# EAGLE design SAME70N21-CU (EAGLE 9.6.1)
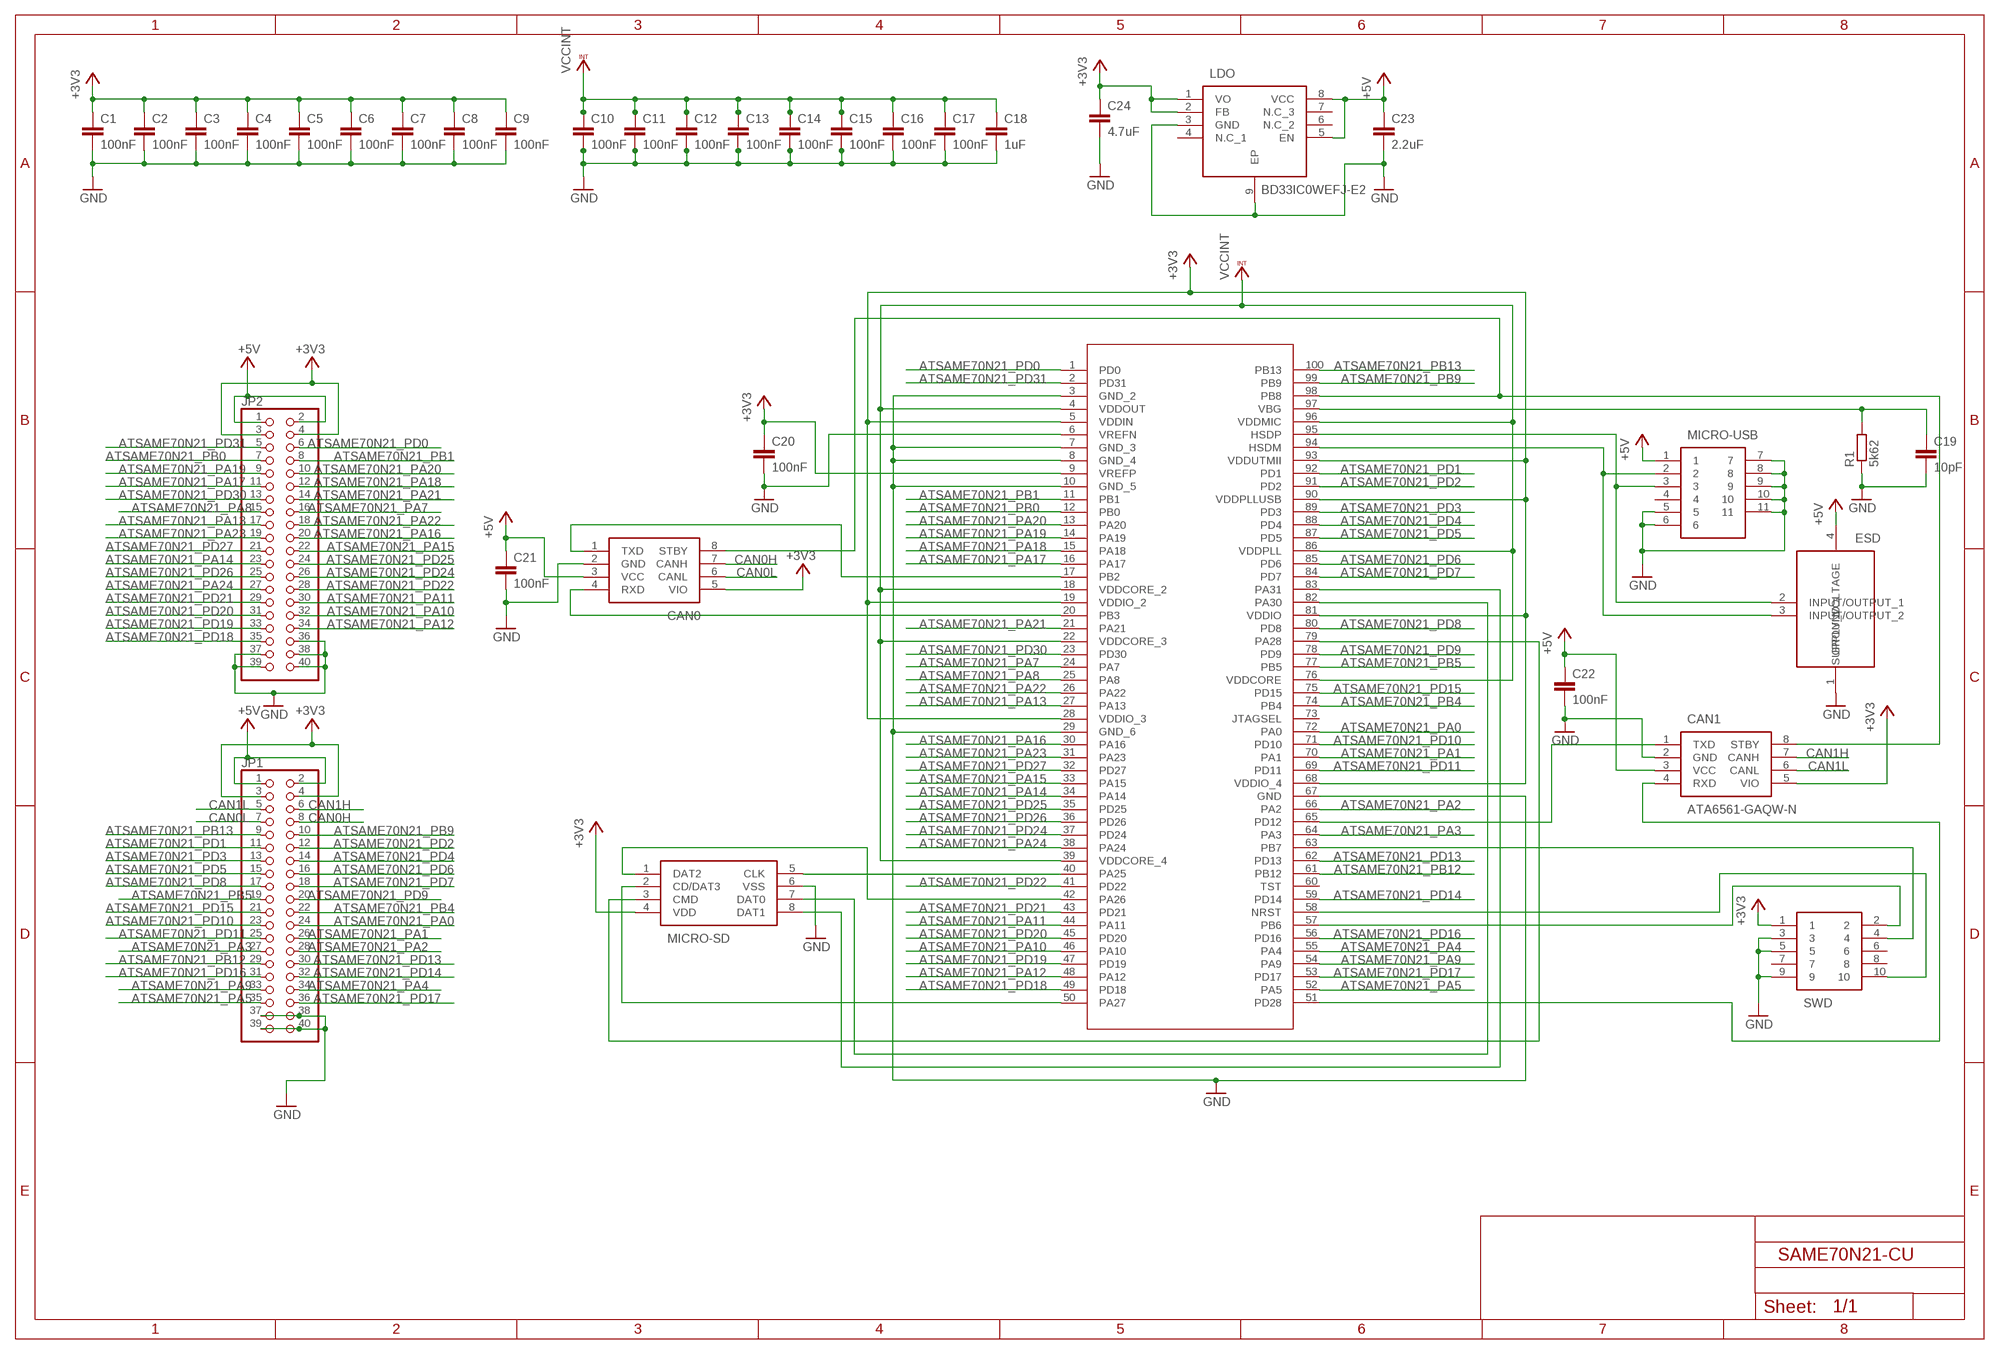
[diagram p0: schematic, sheet 1]

## Parts
C1  100nF  C-EUC1206  [C1206]
C2  100nF  C-EUC1206  [C1206]
C3  100nF  C-EUC1206  [C1206]
C4  100nF  C-EUC1206  [C1206]
C5  100nF  C-EUC1206  [C1206]
C6  100nF  C-EUC1206  [C1206]
C7  100nF  C-EUC1206  [C1206]
C8  100nF  C-EUC1206  [C1206]
C9  100nF  C-EUC1206  [C1206]
C10  100nF  C-EUC1206  [C1206]
C11  100nF  C-EUC1206  [C1206]
C12  100nF  C-EUC1206  [C1206]
C13  100nF  C-EUC1206  [C1206]
C14  100nF  C-EUC1206  [C1206]
C15  100nF  C-EUC1206  [C1206]
C16  100nF  C-EUC1206  [C1206]
C17  100nF  C-EUC1206  [C1206]
C18  1uF  C-EUC1206  [C1206]
C19  10pF  C-EUC1206  [C1206]
C20  100nF  C-EUC1206  [C1206]
C21  100nF  C-EUC1206  [C1206]
C22  100nF  C-EUC1206  [C1206]
C23  2.2uF  C-EUC1206  [C1206]
C24  4.7uF  C-EUC1206  [C1206]
CAN0  ATA6561-GAQW-N  [SOIC127P600X175-8N]
CAN1  ATA6561-GAQW-N  [SOIC127P600X175-8N]
ESD  PRTR5V0U2X,215  [PRTR5V0U2X]
JP1  PINHD-2X20  [2X20]
JP2  PINHD-2X20  [2X20]
LDO  BD33IC0WEFJ-E2  [SOIC127P600X100-9N]
MICRO-SD  104031-0811  [1040310811]
MICRO-USB  10118192-0001LF  [101181920001LF]
R1  5k62  R-EU_R1206  [R1206]
SWD  62201021121  [WURTH-1.27MM-PITCH-2WAY]
U1  ATSAME70N21A-ANTQFP100_14X14MC_MCH-M  [TQFP100_14X14MC_MCH-M]

## Nets
+3V3: C1.1 C2.1 C3.1 C4.1 C5.1 C6.1 C7.1 C8.1 C9.1 C20.1 C24.1 CAN0.5(VIO) CAN1.5(VIO) JP1.3 JP1.4 JP2.3 JP2.4 LDO.1(VO) LDO.2(FB) MICRO-SD.4(VDD) SWD.1 U1.5(VDDIN) U1.9(VREFP) U1.19(VDDIO_2) U1.28(VDDIO_3) U1.68(VDDIO_4) U1.81(VDDIO) U1.90(VDDPLLUSB) U1.93(VDDUTMII)
+5V: C21.1 C22.1 C23.1 CAN0.3(VCC) CAN1.3(VCC) ESD.4(SUPPLY_VOLTAGE) JP1.1 JP1.2 JP2.1 JP2.2 LDO.5(EN) LDO.8(VCC) MICRO-USB.1
ATSAME70N21_PA0: JP1.24 U1.72(PA0)
ATSAME70N21_PA1: JP1.26 U1.70(PA1)
ATSAME70N21_PA2: JP1.28 U1.66(PA2)
ATSAME70N21_PA3: JP1.27 U1.64(PA3)
ATSAME70N21_PA4: JP1.34 U1.55(PA4)
ATSAME70N21_PA5: JP1.35 U1.52(PA5)
ATSAME70N21_PA7: JP2.16 U1.24(PA7)
ATSAME70N21_PA8: JP2.15 U1.25(PA8)
ATSAME70N21_PA9: JP1.33 U1.54(PA9)
ATSAME70N21_PA10: JP2.32 U1.46(PA10)
ATSAME70N21_PA11: JP2.30 U1.44(PA11)
ATSAME70N21_PA12: JP2.34 U1.48(PA12)
ATSAME70N21_PA13: JP2.17 U1.27(PA13)
ATSAME70N21_PA14: JP2.23 U1.34(PA14)
ATSAME70N21_PA15: JP2.22 U1.33(PA15)
ATSAME70N21_PA16: JP2.20 U1.30(PA16)
ATSAME70N21_PA17: JP2.11 U1.16(PA17)
ATSAME70N21_PA18: JP2.12 U1.15(PA18)
ATSAME70N21_PA19: JP2.9 U1.14(PA19)
ATSAME70N21_PA20: JP2.10 U1.13(PA20)
ATSAME70N21_PA21: JP2.14 U1.21(PA21)
ATSAME70N21_PA22: JP2.18 U1.26(PA22)
ATSAME70N21_PA23: JP2.19 U1.31(PA23)
ATSAME70N21_PA24: JP2.27 U1.38(PA24)
ATSAME70N21_PB0: JP2.7 U1.12(PB0)
ATSAME70N21_PB1: JP2.8 U1.11(PB1)
ATSAME70N21_PB4: JP1.22 U1.74(PB4)
ATSAME70N21_PB5: JP1.19 U1.77(PB5)
ATSAME70N21_PB9: JP1.10 U1.99(PB9)
ATSAME70N21_PB12: JP1.29 U1.61(PB12)
ATSAME70N21_PB13: JP1.9 U1.100(PB13)
ATSAME70N21_PD0: JP2.6 U1.1(PD0)
ATSAME70N21_PD1: JP1.11 U1.92(PD1)
ATSAME70N21_PD2: JP1.12 U1.91(PD2)
ATSAME70N21_PD3: JP1.13 U1.89(PD3)
ATSAME70N21_PD4: JP1.14 U1.88(PD4)
ATSAME70N21_PD5: JP1.15 U1.87(PD5)
ATSAME70N21_PD6: JP1.16 U1.85(PD6)
ATSAME70N21_PD7: JP1.18 U1.84(PD7)
ATSAME70N21_PD8: JP1.17 U1.80(PD8)
ATSAME70N21_PD9: JP1.20 U1.78(PD9)
ATSAME70N21_PD10: JP1.23 U1.71(PD10)
ATSAME70N21_PD11: JP1.25 U1.69(PD11)
ATSAME70N21_PD13: JP1.30 U1.62(PD13)
ATSAME70N21_PD14: JP1.32 U1.59(PD14)
ATSAME70N21_PD15: JP1.21 U1.75(PD15)
ATSAME70N21_PD16: JP1.31 U1.56(PD16)
ATSAME70N21_PD17: JP1.36 U1.53(PD17)
ATSAME70N21_PD18: JP2.35 U1.49(PD18)
ATSAME70N21_PD19: JP2.33 U1.47(PD19)
ATSAME70N21_PD20: JP2.31 U1.45(PD20)
ATSAME70N21_PD21: JP2.29 U1.43(PD21)
ATSAME70N21_PD22: JP2.28 U1.41(PD22)
ATSAME70N21_PD24: JP2.26 U1.37(PD24)
ATSAME70N21_PD25: JP2.24 U1.35(PD25)
ATSAME70N21_PD26: JP2.25 U1.36(PD26)
ATSAME70N21_PD27: JP2.21 U1.32(PD27)
ATSAME70N21_PD30: JP2.13 U1.23(PD30)
ATSAME70N21_PD31: JP2.5 U1.2(PD31)
CAN0H: CAN0.7(CANH) JP1.8
CAN0L: CAN0.6(CANL) JP1.7
CAN0RX: CAN0.4(RXD) U1.20(PB3)
CAN0TX: CAN0.1(TXD) U1.17(PB2)
CAN1H: CAN1.7(CANH) JP1.6
CAN1L: CAN1.6(CANL) JP1.5
CAN1RX: CAN1.4(RXD) U1.51(PD28)
CAN1TX: CAN1.1(TXD) U1.65(PD12)
CAN-STBY: CAN0.8(STBY) CAN1.8(STBY) U1.98(PB8)
GND: C1.2 C2.2 C3.2 C4.2 C5.2 C6.2 C7.2 C8.2 C9.2 C10.2 C11.2 C12.2 C13.2 C14.2 C15.2 C16.2 C17.2 C18.2 C19.2 C20.2 C21.2 C22.2 C23.2 C24.2 CAN0.2(GND) CAN1.2(GND) ESD.1(GROUND) JP1.37 JP1.38 JP1.39 JP1.40 JP2.36 JP2.37 JP2.38 JP2.39 JP2.40 LDO.3(GND) LDO.9(EP) MICRO-SD.6(VSS) MICRO-USB.5 MICRO-USB.6 MICRO-USB.7 MICRO-USB.8 MICRO-USB.9 MICRO-USB.10 MICRO-USB.11 R1.1 SWD.3 SWD.5 SWD.9 U1.3(GND_2) U1.6(VREFN) U1.7(GND_3) U1.8(GND_4) U1.10(GND_5) U1.29(GND_6) U1.67(GND)
HSDM: ESD.3(INPUT/OUTPUT_2) MICRO-USB.2 U1.94(HSDM)
HSDP: ESD.2(INPUT/OUTPUT_1) MICRO-USB.3 U1.95(HSDP)
MSD-CLK: MICRO-SD.5(CLK) U1.40(PA25)
MSD-CMD: MICRO-SD.3(CMD) U1.79(PA28)
MSD-DAT0: MICRO-SD.7(DAT0) U1.82(PA30)
MSD-DAT1: MICRO-SD.8(DAT1) U1.83(PA31)
MSD-DAT2: MICRO-SD.1(DAT2) U1.42(PA26)
MSD-DAT3: MICRO-SD.2(CD/DAT3) U1.50(PA27)
NRST: SWD.10 U1.58(NRST)
SWCLK: SWD.4 U1.63(PB7)
SWDIO: SWD.2 U1.57(PB6)
VBG: C19.1 R1.2 U1.97(VBG)
VCCINT: C10.1 C11.1 C12.1 C13.1 C14.1 C15.1 C16.1 C17.1 C18.1 U1.4(VDDOUT) U1.18(VDDCORE_2) U1.22(VDDCORE_3) U1.39(VDDCORE_4) U1.76(VDDCORE) U1.86(VDDPLL) U1.96(VDDMIC)
Unconnected: LDO.4(N.C_1) LDO.6(N.C_2) LDO.7(N.C_3) MICRO-USB.4 SWD.6 SWD.7 SWD.8 U1.60(TST) U1.73(JTAGSEL)

## Library data of the parts
C1-C24 = rcl:C-EU: CAPACITOR, European symbol; SPICEPREFIX: C
CAN0 CAN1 = SamacSys_Parts:ATA6561-GAQW-N: MICROCHIP - ATA6561-GAQW-N - CAN TRANSCEIVER, 5MBPS, -40 TO 150DEG C Source: Datasheet <http://ww1.microchip.com/downloads/en/DeviceDoc/ATA6560-ATA6561-High-Speed-CAN-Transceiver-DS20005991A.pdf>; DESCRIPTION: MICROCHIP - ATA6561-GAQW-N - CAN TRANSCEIVER, 5MBPS, -40 TO 150DEG C; HEIGHT: 1.75mm; MANUFACTURER_NAME: Microchip; MANUFACTURER_PART_NUMBER: ATA6561-GAQW-N; MOUSER_PART_NUMBER: 579-ATA6561-GAQW-N; MOUSER_PRICE-STOCK: https://www.mouser.co.uk/ProductDetail/Microchip-Technology-Atmel/ATA6561-GAQW-N?qs=y6ZabgHbY%252BwGbm2JCZMHKQ%3D%3D
ESD = SamacSys_Parts:PRTR5V0U2X,215: ESD Protection Diodes 5.5V Dual SOT143B NXP PRTR5V0U2X,215 Dual Uni-Directional TVS Diode, 4-Pin SOT-143B Source: Datasheet <https://assets.nexperia.com/documents/data-sheet/PRTR5V0U2X.pdf>; DESCRIPTION: ESD Protection Diodes 5.5V Dual SOT143B NXP PRTR5V0U2X,215 Dual Uni-Directional TVS Diode, 4-Pin SOT-143B; HEIGHT: 1.1mm; MANUFACTURER_NAME: Nexperia; MANUFACTURER_PART_NUMBER: PRTR5V0U2X,215; MOUSER_PART_NUMBER: 771-PRTR5V0U2X-T/R; MOUSER_PRICE-STOCK: https://www.mouser.co.uk/ProductDetail/Nexperia/PRTR5V0U2X215?qs=LOCUfHb8d9sDkgY4cRj8Lw%3D%3D
JP1 JP2 = pinhead:PINHD-2X20: PIN HEADER
LDO = SamacSys_Parts:BD33IC0WEFJ-E2: LDO regulator,3.3V,1A,shutdown,HTSOP-J8 ROHM BD33IC0WEFJ-E2, LDO Voltage Regulator, 1A, 3.3 V +/-1%, 2.4 5.5 Vin, 8-Pin HTSOP-J8 Source: Datasheet <http://rohmfs.rohm.com/en/products/databook/datasheet/ic/power/linear_regulator/bdxxic0w-e.pdf>; DESCRIPTION: LDO regulator,3.3V,1A,shutdown,HTSOP-J8 ROHM BD33IC0WEFJ-E2, LDO Voltage Regulator, 1A, 3.3 V +/-1%, 2.4 5.5 Vin, 8-Pin HTSOP-J8; HEIGHT: 1mm; MANUFACTURER_NAME: ROHM Semiconductor; MANUFACTURER_PART_NUMBER: BD33IC0WEFJ-E2; MOUSER_PART_NUMBER: 755-BD33IC0WEFJ-E2; MOUSER_PRICE-STOCK: https://www.mouser.co.uk/ProductDetail/ROHM-Semiconductor/BD33IC0WEFJ-E2?qs=QbAZ1slfEbT8jlYSJB9fUg%3D%3D
MICRO-SD = SamacSys_Parts:104031-0811: microSD 1.10mm SMT push-pull memory card microSD 1.10mm SMT push-pull memory card Source: Datasheet <http://www.molex.com/webdocs/datasheets/pdf/en-us/1040310811_MEMORY_CARD_SOCKET.pdf>; DESCRIPTION: microSD 1.10mm SMT push-pull memory card microSD 1.10mm SMT push-pull memory card; HEIGHT: mm; MANUFACTURER_NAME: Molex; MANUFACTURER_PART_NUMBER: 104031-0811; MOUSER_PART_NUMBER: 538-104031-0811; MOUSER_PRICE-STOCK: https://www.mouser.co.uk/ProductDetail/Molex/104031-0811?qs=udsGRKD4nA3Tvy7wqky%252BuA%3D%3D
MICRO-USB = SamacSys_Parts:10118192-0001LF: USB Connectors 5P MICRO USB TYPE B RECEPTACLE Source: Datasheet <https://www.mouser.tw/datasheet/2/18/10118192-1361887.pdf>; ARROW_PART_NUMBER: 10118192-0001LF; ARROW_PRICE-STOCK: https://www.arrow.com/en/products/10118192-0001lf/amphenol-fci?region=nac; DESCRIPTION: USB Connectors 5P MICRO USB TYPE B RECEPTACLE; HEIGHT: 2.8mm; MANUFACTURER_NAME: Amphenol; MANUFACTURER_PART_NUMBER: 10118192-0001LF; MOUSER_PART_NUMBER: 649-10118192-0001LF; MOUSER_PRICE-STOCK: https://www.mouser.co.uk/ProductDetail/Amphenol-FCI/10118192-0001LF?qs=Ywefl8B65e5bHFoQtIudZg%3D%3D
R1 = rcl:R-EU_: RESISTOR, European symbol; SPICEPREFIX: R
SWD = SamacSys_Parts:62201021121: Wurth Elektronik WR-PHD Series, Series Number 6220, 1.27mm Pitch 10 Way 2 Row Straight PCB Header, Solder Termination Source: Datasheet <http://katalog.we-online.de/em/datasheet/6220xx21121.pdf>; DESCRIPTION: Wurth Elektronik WR-PHD Series, Series Number 6220, 1.27mm Pitch 10 Way 2 Row Straight PCB Header, Solder Termination; HEIGHT: mm; MANUFACTURER_NAME: Wurth Elektronik; MANUFACTURER_PART_NUMBER: 62201021121; MOUSER_PART_NUMBER: 710-62201021121; MOUSER_PRICE-STOCK: https://www.mouser.co.uk/ProductDetail/Wurth-Elektronik/62201021121?qs=PhR8RmCirEZWrjKrFMt0Bg%3D%3D
U1 = u_mcu_atmel_atsame70n21_lqfp100:ATSAME70N21A-AN; COPYRIGHT: Copyright (C) 2022 Ultra Librarian. All rights reserved.; MANUFACTURER_PART_NUMBER: ATSAME70N21A-AN; MFR_NAME: Microchip

## Board
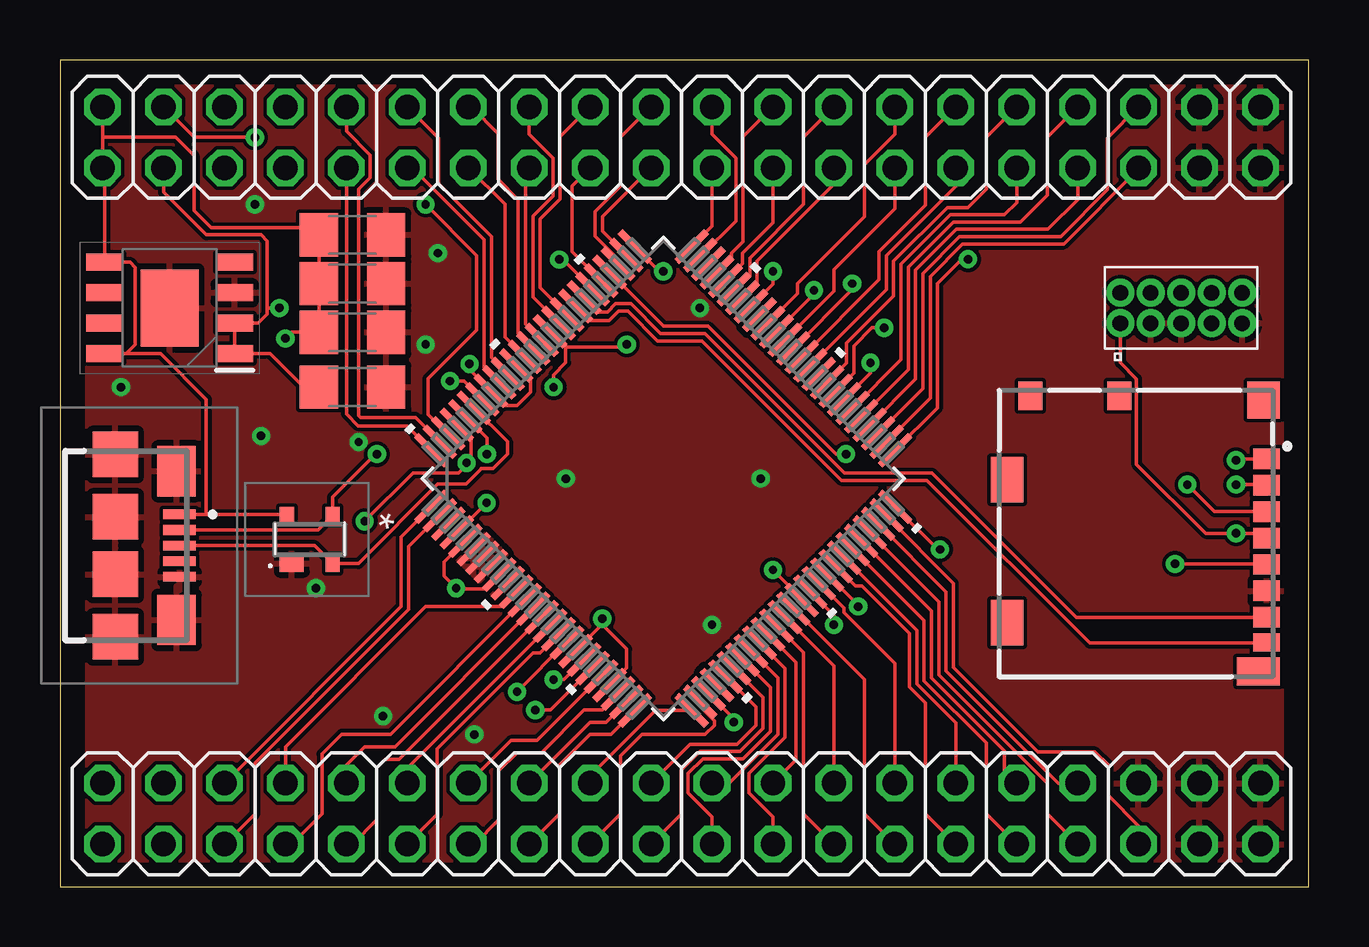
[diagram p1: board, top side]
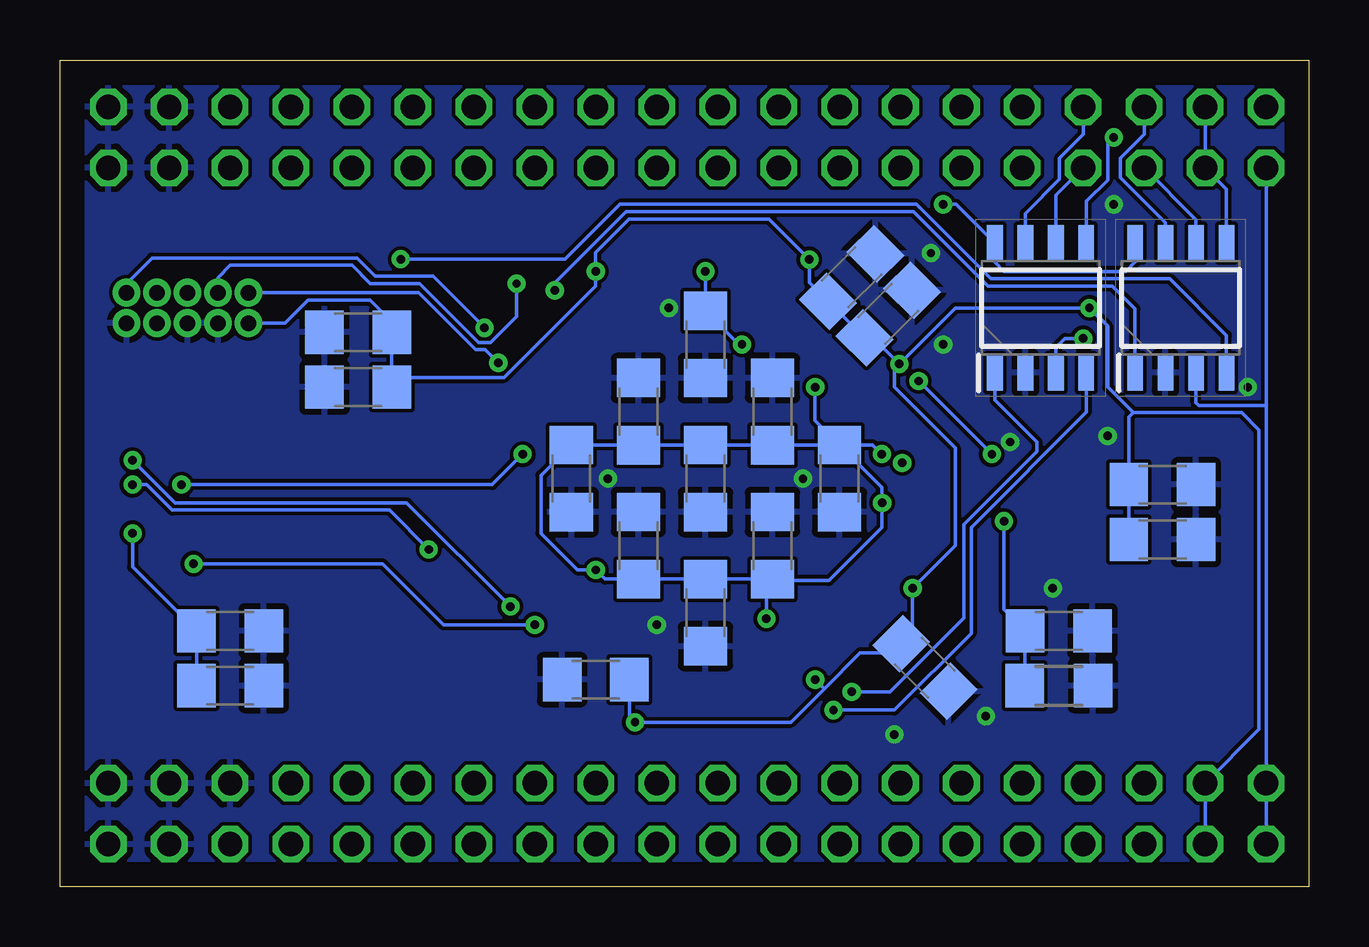
[diagram p2: board, bottom side, seen from below]

Size 52.05 x 34.47 mm. Coordinates in mm from the lower left corner, seen from the top.
Outline: 0,0 52.05,0 52.05,34.47 0,34.47 0,0
Copper layers (1*16): Top 0.035mm / dielectric 1.5mm / Bottom 0.035mm
Design rules "default": minimum track width 6mil, minimum drill 0.35mm, track to track 6mil, track to pad 6mil, pad to pad 6mil, via to via 6mil, smd to smd 6mil, copper to edge 40mil, drill to drill 6mil, minimum pad ring 10mil, minimum via ring 8mil, stop-mask expansion 4mil, vias tented up to drill 0mil, thermal gap 10mil

### Footprints (pad centres in the part's own frame; a part is rotated, then mirrored left to right if it is on the bottom)
C1206 = smd 1.6 x 1.8: 1 -1.4,0; 2 1.4,0
SOIC127P600X175-8N = smd 1.5 x 0.65: 1 -2.7,1.905; 2 -2.7,0.635; 3 -2.7,-0.635; 4 -2.7,-1.905; 5 2.7,-1.905; 6 2.7,-0.635; 7 2.7,0.635; 8 2.7,1.905
PRTR5V0U2X = smd 1 x 0.7: 1 -0.75,-1 | smd 0.6 x 0.7: 2 0.95,-1; 3 0.95,1; 4 -0.95,1
2X20 = drill 1.016 octagon: 1 -24.13,-1.27; 2 -24.13,1.27; 3 -21.59,-1.27; 4 -21.59,1.27; 5 -19.05,-1.27; 6 -19.05,1.27; 7 -16.51,-1.27; 8 -16.51,1.27; 9 -13.97,-1.27; 10 -13.97,1.27; 11 -11.43,-1.27; 12 -11.43,1.27; 13 -8.89,-1.27; 14 -8.89,1.27; 15 -6.35,-1.27; 16 -6.35,1.27; 17 -3.81,-1.27; 18 -3.81,1.27; 19 -1.27,-1.27; 20 -1.27,1.27; 21 1.27,-1.27; 22 1.27,1.27; 23 3.81,-1.27; 24 3.81,1.27; 25 6.35,-1.27; 26 6.35,1.27; 27 8.89,-1.27; 28 8.89,1.27; 29 11.43,-1.27; 30 11.43,1.27; 31 13.97,-1.27; 32 13.97,1.27; 33 16.51,-1.27; 34 16.51,1.27; 35 19.05,-1.27; 36 19.05,1.27; 37 21.59,-1.27; 38 21.59,1.27; 39 24.13,-1.27; 40 24.13,1.27
SOIC127P600X100-9N = smd 1.525 x 0.7: 1 -2.712,1.905; 2 -2.712,0.635; 3 -2.712,-0.635; 4 -2.712,-1.905; 5 2.712,-1.905; 6 2.712,-0.635; 7 2.712,0.635; 8 2.712,1.905 | smd 2.4 x 3.2: 9 0,0
1040310811 = smd 0.85 x 1.1: 1 3.105,0.25; 2 2.005,0.25; 3 0.905,0.25; 4 -0.195,0.25; 5 -1.295,0.25; 6 -2.395,0.25; 7 -3.495,0.25 | smd 0.75 x 1.1: 8 -4.545,0.25 | smd 1.17 x 1.8: 9 -5.755,0.6 | smd 1.9 x 1.35: 10 -3.73,11.075; 11 2.24,11.075 | smd 1.2 x 1: 12 5.74,10.1; 13 5.74,6.4 | smd 1.55 x 1.35: 14 5.565,0.375
101181920001LF = smd 0.4 x 1.35: 1 -1.3,1.682; 2 -0.65,1.682; 3 0,1.682; 4 0.65,1.682; 5 1.3,1.682 | smd 2.1 x 1.6: 6 -3.1,1.557; 7 3.1,1.557 | smd 1.9 x 1.9: 8 -1.2,-0.993; 9 1.2,-0.993; 10 -3.8,-0.993; 11 3.8,-0.993
R1206 = smd 1.6 x 1.803: 1 -1.422,0; 2 1.422,0
WURTH-1.27MM-PITCH-2WAY = drill 0.65 pad 1.05: 1 -2.54,-0.635; 2 -2.54,0.635; 3 -1.27,-0.635; 4 -1.27,0.635; 5 0,-0.635; 6 0,0.635; 7 1.27,-0.635; 8 1.27,0.635; 9 2.54,-0.635; 10 2.54,0.635
TQFP100_14X14MC_MCH-M = smd 1.762 x 0.279: 1 -7.67,6; 2 -7.67,5.5; 3 -7.67,5; 4 -7.67,4.5; 5 -7.67,4; 6 -7.67,3.5; 7 -7.67,3; 8 -7.67,2.5; 9 -7.67,2; 10 -7.67,1.5; 11 -7.67,1; 12 -7.67,0.5; 13 -7.67,0; 14 -7.67,-0.5; 15 -7.67,-1; 16 -7.67,-1.5; 17 -7.67,-2; 18 -7.67,-2.5; 19 -7.67,-3; 20 -7.67,-3.5; 21 -7.67,-4; 22 -7.67,-4.5; 23 -7.67,-5; 24 -7.67,-5.5; 25 -7.67,-6; 51 7.67,-6; 52 7.67,-5.5; 53 7.67,-5; 54 7.67,-4.5; 55 7.67,-4; 56 7.67,-3.5; 57 7.67,-3; 58 7.67,-2.5; 59 7.67,-2; 60 7.67,-1.5; 61 7.67,-1; 62 7.67,-0.5; 63 7.67,0; 64 7.67,0.5; 65 7.67,1; 66 7.67,1.5; 67 7.67,2; 68 7.67,2.5; 69 7.67,3; 70 7.67,3.5; 71 7.67,4; 72 7.67,4.5; 73 7.67,5; 74 7.67,5.5; 75 7.67,6 | smd 0.279 x 1.762: 26 -6,-7.67; 27 -5.5,-7.67; 28 -5,-7.67; 29 -4.5,-7.67; 30 -4,-7.67; 31 -3.5,-7.67; 32 -3,-7.67; 33 -2.5,-7.67; 34 -2,-7.67; 35 -1.5,-7.67; 36 -1,-7.67; 37 -0.5,-7.67; 38 0,-7.67; 39 0.5,-7.67; 40 1,-7.67; 41 1.5,-7.67; 42 2,-7.67; 43 2.5,-7.67; 44 3,-7.67; 45 3.5,-7.67; 46 4,-7.67; 47 4.5,-7.67; 48 5,-7.67; 49 5.5,-7.67; 50 6,-7.67; 76 6,7.67; 77 5.5,7.67; 78 5,7.67; 79 4.5,7.67; 80 4,7.67; 81 3.5,7.67; 82 3,7.67; 83 2.5,7.67; 84 2,7.67; 85 1.5,7.67; 86 1,7.67; 87 0.5,7.67; 88 0,7.67; 89 -0.5,7.67; 90 -1,7.67; 91 -1.5,7.67; 92 -2,7.67; 93 -2.5,7.67; 94 -3,7.67; 95 -3.5,7.67; 96 -4,7.67; 97 -4.5,7.67; 98 -5,7.67; 99 -5.5,7.67; 100 -6,7.67

### Placement (x,y rotation side)
C1  6.1,14.48 0 bottom
C2  16,9.14 315 bottom
C3  29.72,8.64 180 bottom
C4  39.62,23.11 180 bottom
C5  39.62,20.83 180 bottom
C6  19.05,25.4 45 bottom
C7  44.96,10.67 0 bottom
C8  17.53,23.88 45 bottom
C9  44.96,8.38 0 bottom
C10  25.15,22.61 270 bottom
C11  27.94,19.81 90 bottom
C12  22.35,19.81 90 bottom
C13  27.94,14.22 90 bottom
C14  19.56,17.02 270 bottom
C15  25.15,11.43 270 bottom
C16  22.35,14.22 90 bottom
C17  30.73,17.02 270 bottom
C18  25.15,17.02 270 bottom
C19  10.41,10.67 0 bottom
C20  6.1,16.76 0 bottom
C21  12.19,25.15 0 top
C22  12.19,23.11 0 top
C23  12.19,27.18 0 top
C24  12.19,20.83 0 top
CAN0  11.18,24.13 90 bottom
CAN1  5.33,24.13 90 bottom
ESD  10.41,14.48 0 top
JP1  25.91,31.24 0 top
JP2  25.91,3.05 0 top
LDO  4.57,24.13 180 top
MICRO-SD  50.55,14.73 90 top
MICRO-USB  3.3,14.22 270 top
R1  10.41,8.38 180 bottom
SWD  46.74,24.13 0 top
U1  25.15,17.02 45 top

### Tracks (layer width: path | path; a pad name or v marks a point on that pad's centre or on a via)
+3V3  (via drill 0.35)
  Top 0.152: 8.64,24.13 8.64,23.88 8.26,23.5 LDO.2 LDO.1 8.76,22.23 10.16,20.83 C24.1 | 8.64,24.13 8.64,26.92 8.38,27.18 6.1,27.18 4.32,28.96 JP1.3 | v8.13,31.24 5.59,31.24 JP1.4 | 8.64,24.13 v9.14,24.13 | v17.07,21.8 17.07,21.56 U1.93 18.56,20.07 19.05,20.07 19.61,20.63 19.61,21.14 U1.90 | v20.81,26.15 20.96,26.15 U1.81 | v29.72,25.65 29.72,25.13 U1.68 | U1.28 28.08,7.01 v28.08,6.86 | U1.5 16,13.53 16,12.95 v16.51,12.45 16.54,12.41 17.71,12.41 U1.9 | U1.19 21.01,8.64 v20.57,8.64 | SWD.1 44.2,21.84 44.88,21.17 44.88,17.61 47.75,14.73 v49.02,14.73 50.1,14.73 MICRO-SD.4
  Bottom 0.152: JP1.4 JP1.3 3.43,29.08 CAN1.5 | CAN0.5 9.27,28.57 8.38,29.46 8.38,30.99 v8.13,31.24 | v17.07,21.8 14.73,24.13 v9.14,24.13 8.38,23.37 8.38,20.83 7.32,19.76 | v17.07,21.8 18.16,22.89 C8.1 C6.1 20.81,25.18 v20.81,26.15 22.5,27.84 28.32,27.84 29.72,26.44 v29.72,25.65 29.72,25.05 33.53,21.24 37.81,21.24 C5.1 C4.1 38.22,23.57 39.12,24.46 41.7,24.46 42.67,23.5 SWD.1 | 7.32,19.76 2.79,19.76 2.08,19.05 2.08,6.55 JP2.4 JP2.3 | 20.19,8.26 18.7,9.75 17.38,9.75 C2.1 16.51,10.62 v16.51,12.45 14.73,14.22 14.73,18.29 17.27,20.83 17.27,21.59 v17.07,21.8 | 20.19,8.26 21.59,6.86 v28.08,6.86 28.32,7.09 C3.1 | C1.1 C20.1 7.5,19.58 7.32,19.76 | v20.57,8.64 20.19,8.26 | v49.02,14.73 49.02,13.33 C7.1 C9.1
+5V  (via drill 0.35)
  Top 0.152: MICRO-USB.1 6.1,15.52 | 6.1,15.52 9.42,15.52 ESD.4 | 6.1,15.52 6.1,20.32 4.19,22.23 LDO.8 2.76,22.23 3.14,22.61 3.14,25.81 2.92,26.04 LDO.5 1.86,29.89 JP1.1 1.78,31.24 | 1.78,31.24 JP1.2 | 1.78,31.24 4.83,31.24 5.59,30.48 5.59,28.19 6.3,27.48 10.49,27.48 C23.1 C21.1 10.79,23.24 10.67,23.11 | v9.4,22.86 9.65,23.11 10.67,23.11 | 10.67,23.11 C22.1
  Bottom 0.152: CAN0.3 10.54,22.48 10.16,22.86 v9.4,22.86 | JP1.1 1.78,20.07 | 1.78,20.07 JP2.2 JP2.1 | 1.78,20.07 4.57,20.07 4.7,20.19 CAN1.3
ATSAME70N21_PA0
  Top 0.152: U1.72 27.45,25.62 27.98,26.15 27.98,26.41 28.47,26.89 28.47,31.27 JP1.24
ATSAME70N21_PA1
  Top 0.152: U1.70 28.16,24.92 28.75,25.51 28.75,26.21 30.99,28.45 30.99,31.24 JP1.26
ATSAME70N21_PA2
  Top 0.152: JP1.28 34.8,31.37 33.53,30.1 33.53,27.94 30.73,25.15 30.73,24.73 U1.66
ATSAME70N21_PA3
  Top 0.152: JP1.27 34.8,28.27 32.26,25.73 32.26,24.84 U1.64
ATSAME70N21_PA4
  Top 0.152: U1.55 35.36,21.57 35.36,25.82 37.24,27.71 40.03,27.71 41.15,28.82 41.15,31.24 JP1.34
ATSAME70N21_PA5
  Top 0.152: JP1.35 44.96,29.92 41.84,26.8 37.62,26.8 36.27,25.45 36.27,20.36 U1.52
ATSAME70N21_PA7
  Top 0.152: U1.24 22.76,6.86 22.1,6.86 JP2.16
ATSAME70N21_PA8
  Top 0.152: JP2.15 20.83,3.05 20.83,5.08 22.1,6.35 22.96,6.35 U1.25
ATSAME70N21_PA9
  Top 0.152: JP1.33 42.42,28.65 41.18,27.41 37.37,27.41 35.66,25.7 35.66,21.17 U1.54
ATSAME70N21_PA10
  Top 0.152: U1.46 36.32,11.5 36.32,8.71 39.37,5.67 39.37,4.83 JP2.32
ATSAME70N21_PA11
  Top 0.152: U1.44 35.71,10.69 35.71,8.46 37.34,6.83 JP2.30
ATSAME70N21_PA12
  Top 0.152: U1.48 36.93,12.3 36.93,8.99 41.61,4.32 JP2.34
ATSAME70N21_PA13
  Top 0.152: JP2.17 23.37,3.05 23.37,5.46 24.26,6.35 26.89,6.35 27.28,6.73 27.28,6.92 26.68,7.52 U1.27
ATSAME70N21_PA14
  Top 0.152: U1.34 30.23,9.11 30.23,6.23 28.73,4.73 28.73,3.91 29.72,2.92 JP2.23
ATSAME70N21_PA15
  Top 0.152: U1.33 29.92,8.71 29.92,6.35 27.89,4.32 JP2.22
ATSAME70N21_PA16
  Top 0.152: U1.30 29.01,7.5 29.01,6.73 28.22,5.94 26.26,5.94 JP2.20
ATSAME70N21_PA17
  Top 0.152: U1.16 20,9.75 19.72,9.75 15.72,5.75 15.72,3.02 JP2.11
ATSAME70N21_PA18
  Top 0.152: U1.15 14.48,4.94 JP2.12
ATSAME70N21_PA19
  Top 0.152: JP2.9 12.19,1.78 13.21,2.79 13.21,4.96 13.56,5.31 14.14,5.31 U1.14
ATSAME70N21_PA20
  Top 0.152: JP2.10 11.94,5.08 12.7,5.84 13.97,5.84 U1.13
ATSAME70N21_PA21
  Top 0.152: U1.21 19.88,6.1 18.8,6.1 JP2.14
ATSAME70N21_PA22
  Top 0.152: JP2.18 22.1,4.62 24.83,7.35 U1.26
ATSAME70N21_PA23
  Top 0.152: JP2.19 25.88,3.02 25.88,4.86 26.67,5.64 28.34,5.64 29.31,6.61 29.31,7.9 U1.31
ATSAME70N21_PA24
  Top 0.152: U1.38 33.53,8.64 33.53,3.05 JP2.27
ATSAME70N21_PB0
  Top 0.152: U1.12 13.78,6.36 11.75,6.36 10.92,5.53 10.92,3.05 9.65,1.78 JP2.7
ATSAME70N21_PB1
  Top 0.152: U1.11 18.4,11.68 15.24,11.68 9.4,5.84 JP2.8
ATSAME70N21_PB4
  Top 0.152: U1.74 26.75,26.33 28.17,27.75 28.17,30.38 27.18,31.37 JP1.22
ATSAME70N21_PB5
  Top 0.152: U1.77 22.61,27.34 22.61,27.94 JP1.19
ATSAME70N21_PB9
  Top 0.152: U1.99 14.82,19.57 12.53,19.57 12.45,19.65 12.45,29.08 12.93,29.56 12.93,30.5 11.94,31.5 JP1.10
ATSAME70N21_PB12
  Top 0.152: U1.61 34.44,24.9 34.44,26.31 37.34,29.21 JP1.29
ATSAME70N21_PB13
  Top 0.152: U1.100 14.46,19.21 12.43,19.21 11.94,19.71 JP1.9
ATSAME70N21_PD0
  Top 0.152: U1.1 14.22,14.58 14.22,11.68 JP2.6
ATSAME70N21_PD1
  Top 0.152: JP1.11 14.68,29.97 17.68,26.97 17.68,21.66 U1.92
ATSAME70N21_PD2
  Top 0.152: JP1.12 15.77,31.22 15.77,29.31 17.98,27.1 17.98,22.06 U1.91
ATSAME70N21_PD3
  Top 0.152: U1.89 18.54,22.91 18.54,28.45 JP1.13
ATSAME70N21_PD4
  Top 0.152: U1.88 19.1,23.06 19.1,28.65 18.26,29.49 18.26,31.4 17.15,32.51 JP1.14
ATSAME70N21_PD5
  Top 0.152: U1.87 19.41,23.47 19.41,29.82 JP1.15
ATSAME70N21_PD6
  Top 0.152: U1.85 19.71,24.57 19.71,27.96 20.55,28.8 20.55,30.38 19.56,31.37 JP1.16
ATSAME70N21_PD7
  Top 0.152: U1.84 20.02,24.98 20.02,27.84 20.85,28.67 20.85,31.27 JP1.18
ATSAME70N21_PD8
  Top 0.152: U1.80 21.34,26.48 21.34,29.21 JP1.17
ATSAME70N21_PD9
  Top 0.152: U1.78 23.26,26.16 22.3,27.12 22.3,28.14 23.37,29.21 23.37,31.24 JP1.20
ATSAME70N21_PD10
  Top 0.152: U1.71 28.45,25.98 28.45,26.42 29.72,27.69 JP1.23
ATSAME70N21_PD11
  Top 0.152: U1.69 28.52,24.56 29.06,25.1 29.06,26.09 32.26,29.29 JP1.25
ATSAME70N21_PD13
  Top 0.152: JP1.30 36.07,31.24 36.07,28.42 34.14,26.49 34.14,25.3 U1.62
ATSAME70N21_PD14
  Top 0.152: U1.59 32.78,21.82 32.78,22.67 34.75,24.63 34.75,26.08 36.99,28.32 37.85,28.32 38.61,29.08 38.61,31.24 JP1.32
ATSAME70N21_PD15
  Top 0.152: U1.75 27.18,27.54 JP1.21
ATSAME70N21_PD16
  Top 0.152: U1.56 35.05,21.97 35.05,25.95 37.12,28.02 39.37,28.02 39.88,28.52 JP1.31
ATSAME70N21_PD17
  Top 0.152: JP1.36 43.66,31.22 43.66,29.05 41.71,27.1 37.5,27.1 35.97,25.57 35.97,20.77 U1.53
ATSAME70N21_PD18
  Top 0.152: U1.49 34.46,15.43 37.24,12.65 37.24,9.14 40.75,5.62 43.15,5.62 43.69,5.08 43.69,3.81 44.96,2.54 JP2.35
ATSAME70N21_PD19
  Top 0.152: U1.47 33.75,14.75 36.63,11.87 36.63,8.84 41.15,4.32 41.15,3.05 JP2.33
ATSAME70N21_PD20
  Top 0.152: U1.45 36.02,11.1 36.02,8.59 38.61,6 38.61,3.05 JP2.31
ATSAME70N21_PD21
  Top 0.152: U1.43 33.16,12.54 33.43,12.54 35.41,10.57 35.41,8.33 36.07,7.67 36.07,3.05 JP2.29
ATSAME70N21_PD22
  Top 0.152: U1.41 32.67,11.62 32.67,11.43 34.8,9.3 JP2.28
ATSAME70N21_PD24
  Top 0.152: U1.37 32.26,9.2 JP2.26
ATSAME70N21_PD25
  Top 0.152: U1.35 30.68,9.36 30.68,5.28 JP2.24
ATSAME70N21_PD26
  Top 0.152: U1.36 30.99,9.76 30.99,3.05 JP2.25
ATSAME70N21_PD27
  Top 0.152: JP2.21 27.18,2.92 26.19,3.91 26.19,4.73 26.79,5.33 28.47,5.33 29.62,6.48 29.62,8.3 U1.32
ATSAME70N21_PD30
  Top 0.152: JP2.13 17.27,1.78 18.29,2.79 18.29,4.83 19.05,5.59 20.07,5.59 21.84,7.37 22.61,7.37 23.26,8.02 U1.23
ATSAME70N21_PD31
  Top 0.152: JP2.5 8.13,3.05 8.13,5.16 14.53,11.56 14.53,14.18 U1.2
CAN0H
  Bottom 0.152: CAN0.7 11.81,28.07 10.39,29.49 10.39,30.38 9.4,31.37 JP1.8
CAN0L
  Bottom 0.152: CAN0.6 10.54,28.83 JP1.7
CAN0RX  (via drill 0.35)
  Top 0.152: U1.20 20.44,7.37 v19.81,7.37
  Bottom 0.152: v19.81,7.37 17.27,7.37 14.07,10.57 14.07,14.98 9.27,19.78 CAN0.4
CAN0TX  (via drill 0.35)
  Top 0.152: v19.05,8.13 21.1,10.18 U1.17
  Bottom 0.152: CAN0.1 13.08,20.29 11.33,18.54 11.33,18.15 14.37,15.11 14.37,11.2 17.45,8.13 v19.05,8.13
CAN1H
  Bottom 0.152: CAN1.7 5.97,27.68 7.85,29.56 7.85,30.38 6.86,31.37 JP1.6
CAN1L
  Bottom 0.152: CAN1.6 4.7,27.81 JP1.5
CAN1RX  (via drill 0.35)
  Top 0.152: v37.85,26.16 37.59,26.16 36.58,25.15 36.58,19.96 U1.51
  Bottom 0.152: CAN1.4 3.43,22.99 5.79,25.35 13.25,25.35 16.35,28.45 28.7,28.45 30.99,26.16 v37.85,26.16
CAN1TX  (via drill 0.35)
  Top 0.152: v31.43,24.86 31.43,24.71 U1.65
  Bottom 0.152: CAN1.1 7.24,24.1 8.18,25.04 13.38,25.04 16.48,28.14 28.45,28.14 31.43,25.16 v31.43,24.86
CAN-STBY  (via drill 0.35)
  Top 0.152: U1.98 16.12,18.91 15.34,19.69 15.34,21.18 17.37,23.22 17.37,26.31 v15.24,28.45
  Bottom 0.152: CAN1.8 7.24,26.04 7.62,25.65 12.7,25.65 13.08,26.04 CAN0.8 14.7,28.45 v15.24,28.45
GND  (via drill 0.35)
  other vias: 8.13,28.45 8.38,18.8 15.24,22.61 15.75,26.42 2.54,20.83 26.67,24.13 12.45,18.54 10.67,12.45 21.08,17.02 17.27,6.35 13.46,7.11 29.21,17.02 27.18,10.92
  pour Top: 0,0 0,34.54 52.07,34.54 52.07,0
  pour Bottom: 0,0 0,34.54 52.07,34.54 52.07,0
HSDM  (via drill 0.35)
  Top 0.152: MICRO-USB.2 10.76,14.87 ESD.3 11.36,16.24 13.16,18.03 v13.21,18.03 | U1.94 16.84,21.08 v16.26,21.08
  Bottom 0.152: v16.26,21.08 v13.21,18.03
HSDP
  Top 0.152: U1.95 18.65,18.56 18.65,18.04 18.04,17.43 17.55,17.43 17.55,17.42 16.92,16.79 15.75,16.79 12.44,13.48 ESD.2 10.62,14.22 MICRO-USB.3 4.98,14.25
MSD-CLK  (via drill 0.35)
  Top 0.152: U1.40 32.26,11.32 v32.26,10.92 | v46.48,13.46 50.27,13.46 MICRO-SD.5
  Bottom 0.152: v32.26,10.92 36.07,10.92 38.61,13.46 v46.48,13.46
MSD-CMD  (via drill 0.35)
  Top 0.152: U1.79 25.16,23.37 27,23.37 32.34,18.03 v32.77,18.03 | v46.99,16.76 48.12,15.64 MICRO-SD.3
  Bottom 0.152: v32.77,18.03 34.04,16.76 v46.99,16.76
MSD-DAT0
  Top 0.152: U1.82 22.44,23.97 22.82,23.97 23.15,24.3 23.79,24.3 25.03,23.06 26.88,23.06 32.69,17.25 36.34,17.25 42.36,11.24 MICRO-SD.7
MSD-DAT1
  Top 0.152: U1.83 22.09,23.61 22.89,23.61 23.28,24 23.67,24 24.91,22.76 26.75,22.76 32.57,16.94 36.14,16.94 42.93,10.16 50.27,10.16 MICRO-SD.8
MSD-DAT2  (via drill 0.35)
  Top 0.152: U1.42 33.27,11.72 v33.27,11.68 | v49.02,17.78 49.08,17.84 MICRO-SD.1
  Bottom 0.152: v33.27,11.68 37.59,16 47.24,16 v49.02,17.78
MSD-DAT3  (via drill 0.35)
  Top 0.152: U1.50 36.59,14.06 v36.68,14.06 | v49.02,16.76 50.27,16.76 MICRO-SD.2
  Bottom 0.152: v36.68,14.06 38.32,15.7 47.37,15.7 48.44,16.76 v49.02,16.76
NRST  (via drill 0.35)
  Top 0.152: U1.58 33.09,21.42 33.09,22.54 33.85,23.3 v34.35,23.3
  Bottom 0.152: SWD.10 49.28,25.15 48.21,26.21 39.67,26.21 38.91,25.45 36.5,25.45 v34.35,23.3
SWCLK  (via drill 0.35)
  Top 0.152: U1.63 33.02,24.89 v33.02,25.15
  Bottom 0.152: v33.02,25.15 33.02,23.78 34.1,22.7 34.61,22.7 37.06,25.15 39.12,25.15 39.88,25.91 44.96,25.91 45.47,25.4 SWD.4
SWDIO  (via drill 0.35)
  Top 0.152: v33.78,21.84 33.78,21.41 U1.57
  Bottom 0.152: v33.78,21.84 34.33,22.39 34.73,22.39 37.11,24.77 SWD.2
VBG  (via drill 0.35)
  Top 0.152: U1.97 17.14,18.66 17.14,17.86 v16.95,17.67 16.95,17.59 16.61,17.25 14.71,17.25 v12.7,15.24
  Bottom 0.152: R1.2 11.84,10.65 C19.1 12.7,11.55 v12.7,15.24
VCCINT  (via drill 0.35)
  Top 0.152: U1.96 17.79,18.71 v17.79,18.03 | v29.72,13.21 30.92,12 U1.39 | U1.18 22.6,10.93 | 22.6,10.93 22.61,10.94 v22.61,11.18 | v20.57,20.83 20.57,21.34 21.08,21.84 21.08,22.5 | 21.08,22.5 U1.86 | v23.62,22.61 23.51,22.5 21.08,22.5 | U1.76 25,25.65 v25.15,25.65 | U1.22 23.62,9.13 23.62,9.91 22.6,10.93 | v17.78,16 16.55,14.78 U1.4
  Bottom 0.152: v17.79,18.03 18.18,18.42 C14.1 | C14.1 C12.1 C18.1 C11.1 C17.1 32,17.15 32,14.73 30.48,13.21 v29.72,13.21 29.33,12.82 C13.1 C15.1 C16.1 22.41,12.76 | v22.61,11.18 22.61,12.57 22.41,12.76 | C14.1 20.57,19.43 v20.57,20.83 | v23.62,22.61 23.75,22.61 C10.1 v25.15,25.65 | C14.1 17.78,16.64 v17.78,16 17.78,14.99 20,12.76 22.41,12.76